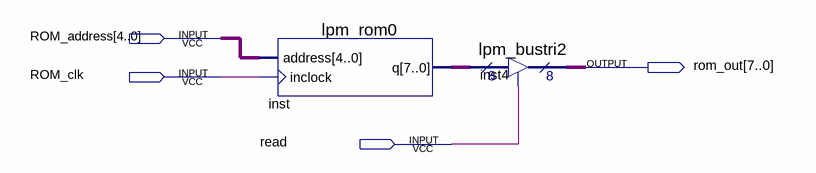
[diagram p0: schematic sheet]
// Quartus schematic ROM.bdf as structural Verilog: 2 symbols, 4 pins
module ROM (
  input  [4:0] ROM_address,
  input  ROM_clk,
  input  read,
  output [7:0] rom_out
);

  wire [7:0] inst_q;

  lpm_rom0 inst (.address(ROM_address), .inclock(ROM_clk), .q(inst_q));
  lpm_bustri2 inst4 (.enabledt(read), .data(inst_q), .tridata(rom_out));
endmodule
